# Altium schematic sheet POWER.SchDoc
size A4
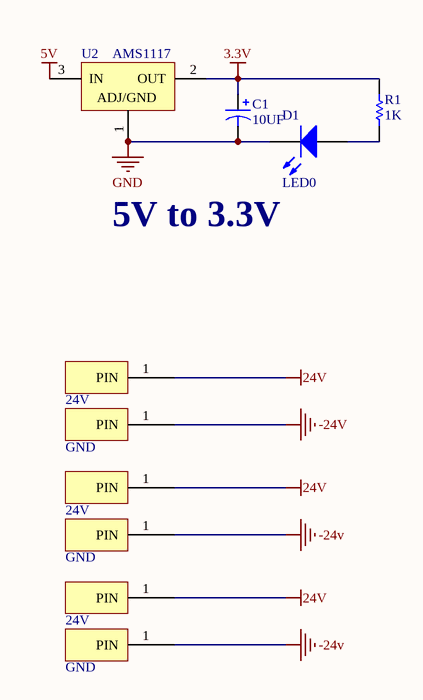
[diagram p0: POWER.SchDoc]

## Parts
C1  10UF  [1812(4532)]
D1  LED0  [LED]
P10  24V  [KF508]
P11  GND  [KF508]
P12  24V  [KF508]
P13  GND  [KF508]
P14  24V  [KF508]
P15  GND  [KF508]
R1  1K  [0603(1608)]
U2  AMS1117  [SOT223-4M]

## Nets
3.3V: C1.1 R1.1 U2.2(OUT)
5V: U2.3(IN)
24V: P10.1(PIN) P12.1(PIN) P14.1(PIN)
-24V: P11.1(PIN) P13.1(PIN) P15.1(PIN)
GND: C1.2 D1.2(K) U2.1
NetD1_1: D1.1(A) R1.2

## Notes on the sheet
- 5V to 3.3V
- (in symbol AMS1117) ADJ/GND

## Library data of the parts
C1 = Cap Pol3: Polarized Capacitor (Surface Mount); Published: 8-Jun-2000; LatestRevisionDate: 29-May-2009; LatestRevisionNote: IPC-7351 Footprint Added.; PackageReference: C0805; Publisher: Altium Limited; Value: 10UF; PackageDescription: Chip Capacitor
D1 = LED0: Typical INFRARED GaAs LED; Published: 8-Jun-2000; LatestRevisionDate: 08-Jul-2005; LatestRevisionNote: Mech Layer 1 removed.; PackageReference: LED-0; Publisher: Altium Limited; PackageDescription: LED; 2 Leads
P10-P15 = KF508: Power Socket 20A
R1 = Res Semi: Semiconductor Resistor; Published: 8-Jun-2000; LatestRevisionDate: 17-Jul-2002; LatestRevisionNote: Re-released for DXP Platform.; PackageReference: AXIAL-0.5; Publisher: Altium Limited; Value: 1K
U2 = AMS1117: DC-DC Convertor 3.3V